# EAGLE design wifi (EAGLE 7.3.0)
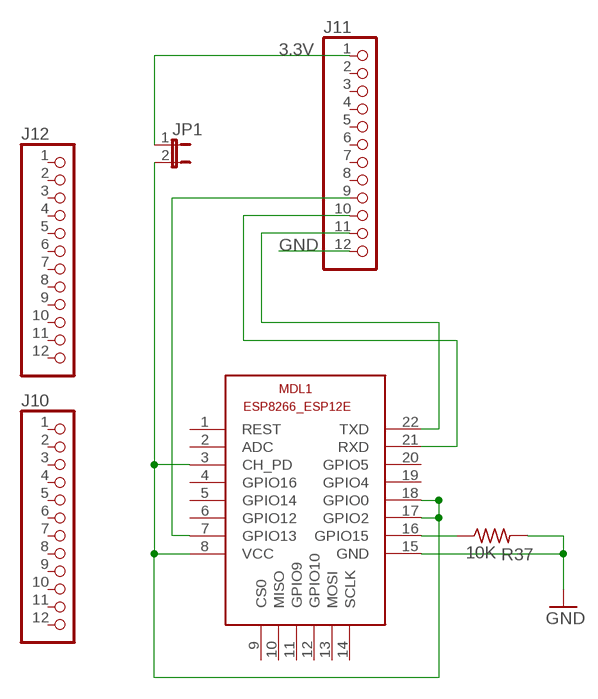
[diagram p0: schematic, sheet 1]

## Parts
J10  PINHD-1X12  [1X12]
J11  PINHD-1X12  [1X12]
J12  PINHD-1X12  [1X12]
JP1  JP1E  [JP1]
MDL1  ESP8266-12EESP8266-ESP12E  [ESP8266-ESP12E]
R37  10K  R-US_R0805  [R0805]

## Nets
3.3V: J11.1 JP1.1
GND: J11.12 MDL1.15(GND) R37.2
N$1: MDL1.16(GPIO15) R37.1
N$2: J11.9 MDL1.7(GPIO13)
N$3: J11.10 MDL1.21(RXD)
N$4: J11.11 MDL1.22(TXD)
VIN: JP1.2 MDL1.3(CH_PD) MDL1.8(VCC) MDL1.17(GPIO2) MDL1.18(GPIO0)
Unconnected: J10.1 J10.2 J10.3 J10.4 J10.5 J10.6 J10.7 J10.8 J10.9 J10.10 J10.11 J10.12 J11.2 J11.3 J11.4 J11.5 J11.6 J11.7 J11.8 J12.1 J12.2 J12.3 J12.4 J12.5 J12.6 J12.7 J12.8 J12.9 J12.10 J12.11 J12.12 MDL1.1(REST) MDL1.2(ADC) MDL1.4(GPIO16) MDL1.5(GPIO14) MDL1.6(GPIO12) MDL1.9(CS0) MDL1.10(MISO) MDL1.11(GPIO9) MDL1.12(GPIO10) MDL1.13(MOSI) MDL1.14(SCLK) MDL1.19(GPIO4) MDL1.20(GPIO5)

## Library data of the parts
J10-J12 = pinhead:PINHD-1X12: PIN HEADER
JP1 = jumper:JP1E: JUMPER
MDL1 = ESP8266-ESP12E:ESP8266-12E: ESP8266-12E with additional I/O and GPIO04/05 corrected The author cannot warrant that this library is free from error or will meet your specific requirements. Created by PuceBaboon.com. Komagane, Nagano, JAPAN
R37 = rcl:R-US_: RESISTOR, American symbol

## Board
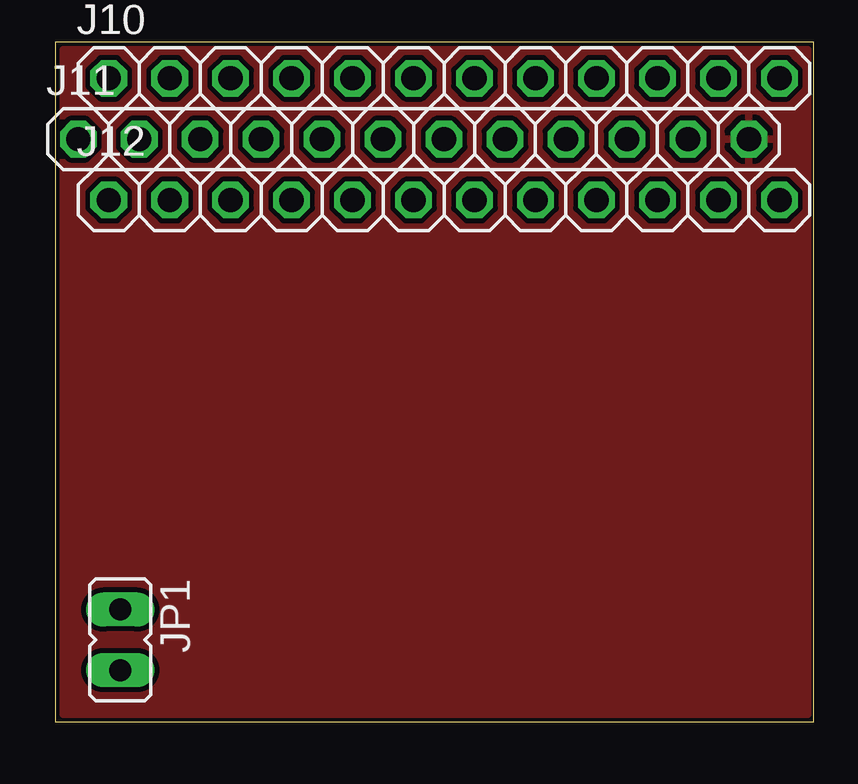
[diagram p1: board, top side]
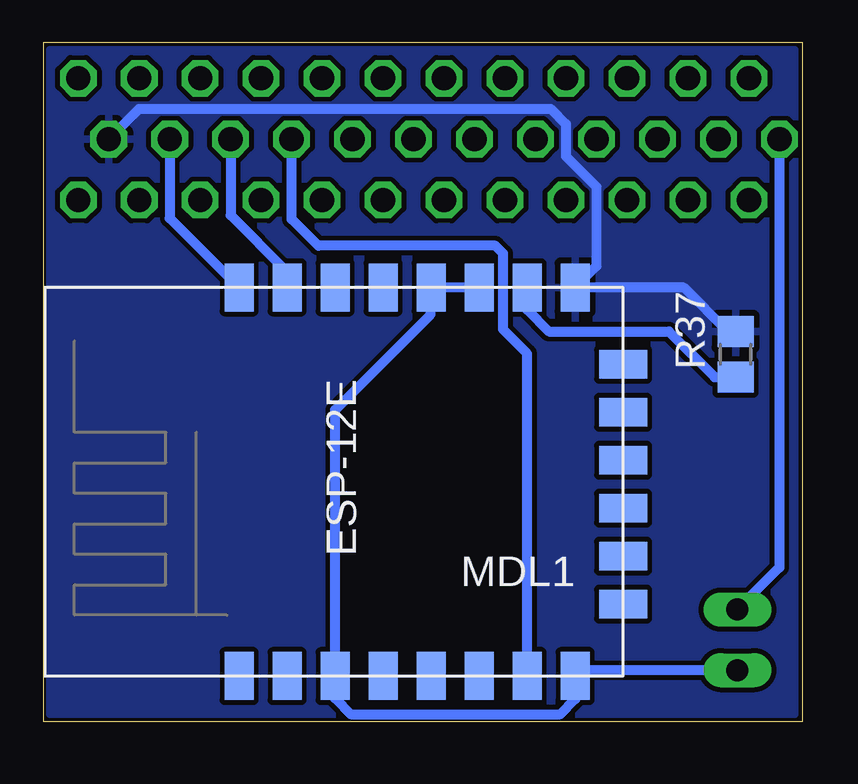
[diagram p2: board, bottom side, seen from below]

No outline drawn. Coordinates in mm, seen from the top.
Copper layers (1*16): Top 0.035mm / dielectric 1.5mm / Bottom 0.035mm
Design rules "default": minimum track width 10mil, minimum drill 24mil, track to track 8mil, track to pad 8mil, pad to pad 8mil, via to via 8mil, smd to smd 8mil, copper to edge 40mil, drill to drill 8mil, minimum pad ring 10mil, minimum via ring 8mil, stop-mask expansion 4mil, vias tented up to drill 0mil, thermal gap 10mil
Milling: 4 lines

### Footprints (pad centres in the part's own frame; a part is rotated, then mirrored left to right if it is on the bottom)
1X12 = drill 1.016 octagon: 1 -13.97,0; 2 -11.43,0; 3 -8.89,0; 4 -6.35,0; 5 -3.81,0; 6 -1.27,0; 7 1.27,0; 8 3.81,0; 9 6.35,0; 10 8.89,0; 11 11.43,0; 12 13.97,0
JP1 = drill 0.914 long: 1 0,-1.27; 2 0,1.27
ESP8266-ESP12E = smd 2 x 1.2: 1 0,16; 2 0,14; 3 0,12; 4 0,10; 5 0,8; 6 0,6; 7 0,4; 8 0,2; 15 16.2,2; 16 16.2,4; 17 16.2,6; 18 16.2,8; 19 16.2,10; 20 16.2,12; 21 16.2,14; 22 16.2,16 | smd 1.2 x 2: 9 3,0; 10 5,0; 11 7,0; 12 9,0; 13 11,0; 14 13,0
R0805 = smd 1.3 x 1.5: 1 -0.95,0; 2 0.95,0

### Placement (x,y rotation side)
J10  16.19,26.83 0 top
J11  14.92,24.29 0 top
J12  16.19,21.75 0 top
JP1  2.7,3.41 180 top
MDL1  7.46,1.91 90 bottom
R37  2.78,15.32 90 bottom

### Tracks (layer width: path | path; a pad name or v marks a point on that pad's centre or on a via)
3.3V
  Bottom 0.406: J11.1 0.95,6.43 JP1.1
GND
  Bottom 0.406: R37.2 3.09,16.27 4.92,18.1 9.45,18.1 MDL1.15 8.57,18.99 8.57,22.3 9.84,23.57 9.84,24.92 10.48,25.56 27.62,25.56 J11.12
  pour Bottom: 0.32,28.02 31.35,28.02 31.35,0.32 0.32,0.32
  pour Top: 0.32,28.02 31.35,28.02 31.35,0.32 0.32,0.32
N$1
  Bottom 0.406: MDL1.16 11.46,17.18 10.56,16.27 5.56,16.27 3.65,14.37 R37.1
N$2
  Bottom 0.406: MDL1.7 11.46,15.35 12.46,16.35 12.46,19.53 12.78,19.84 20.16,19.84 21.27,20.95 J11.9
N$3
  Bottom 0.406: J11.10 23.81,21.11 21.51,18.81 21.51,18.15 MDL1.21
N$4
  Bottom 0.406: J11.11 26.35,21 MDL1.22
VIN
  Bottom 0.406: JP1.2 9.22,2.14 MDL1.8 9.45,1.89 9.45,0.95 10.08,0.32 18.81,0.32 19.46,0.97 MDL1.3 19.46,13 15.48,16.99 15.48,18.09 MDL1.18 MDL1.17